# Altium project PCB_Project_3.PrjPcb
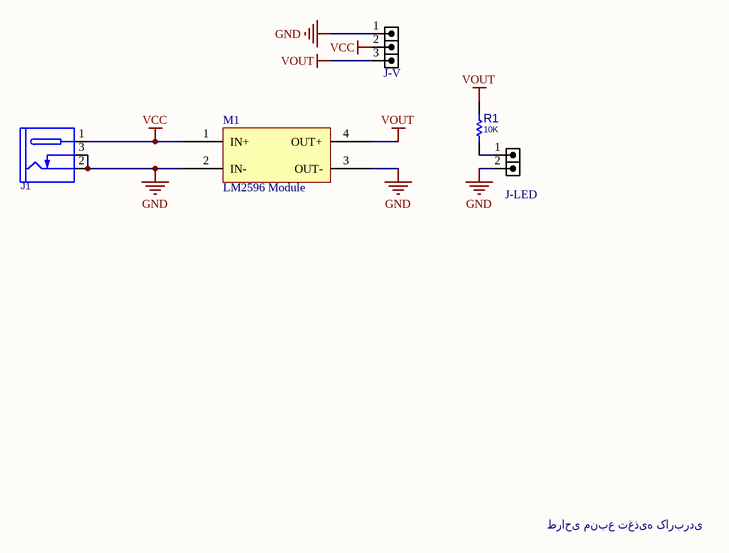
[diagram p0: Sheet1.SchDoc]
1 sheet, 5 parts. Net scope: global (net labels, ports and power ports of the same name join across sheets).
Board file: PCB1.PcbDoc

## Sheet Sheet1.SchDoc
size A; SheetNumber: 1; SheetTotal: 1

### Parts
J1  DC_POWER_JACK  [JAC_PWR2]  (value not drawn)
J-LED  HDRM2  [HDR_M_1X2]  (value not drawn)
J-V  HDRM3  [HDR_M_1X3]  (value not drawn)
M1  LM2596 Module  [DC-DC-MODULE]
R1  10K  [R025W_AX04]

### Nets
GND: J1.2(SLEEVE) J1.3(INSERTION_DET) J-LED.2 J-V.1 M1.2(IN-) M1.3(OUT-)
VCC: J1.1(TIP) J-V.2 M1.1(IN+)
VOUT: J-V.3 M1.4(OUT+) R1.2
NetJ-LED_1: J-LED.1 R1.1

### Notes on the sheet
- طراحی منبع تغذیه کاربردی

### Library data of the parts
J1 = CONN_PWR_JACKR2: CONN, PWR JACK DC, PLUG DIAM 2.0MM RA THD; MANF: CUI STACK; MANF_P#: PJ-202A, PJ-002AH, PJ-102AH, KLDX-0202; VALUE: DC_POWER_JACK
J-LED = HDR_M_1X2: CONN, HEADER, Male, pitch: 2.54mm, 2POS; VALUE: HDRM2
J-V = HDR_M_1X3: CONN, HEADER, Male, pitch: 2.54mm, 3POS; VALUE: HDRM3
M1 = MODULE-DC-DC: LM2596 , Power Module ,  Step-Down Voltage Regulator Module
R1 = RES_THD: RESISTOR, THD; MANF_P#: RK73H1ETTP4701F; MANF: KOA SPEER; PARAM: 0.063W; DESC: DESCRIPTION; DIST#: MOUSER; PARAM2: 1%; ASSEMBLY: ASSEMBLY; PRICE: 100= 0.5$; VALUE: 10K